# EAGLE schematic power mux-v3 (EAGLE 6.5.0)
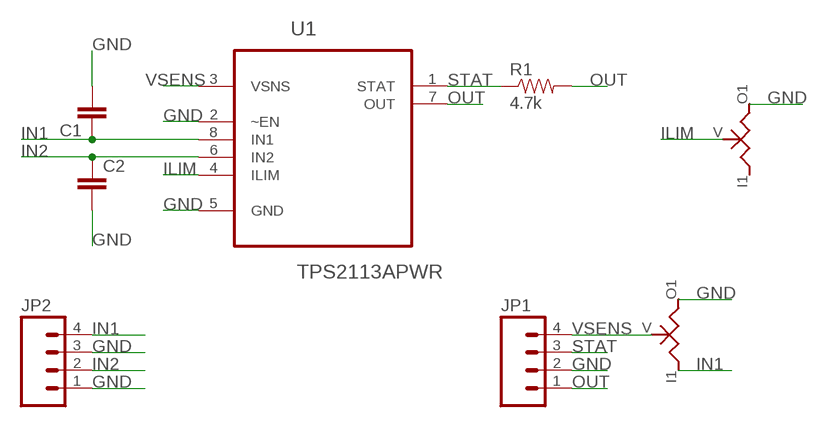
[diagram p0: schematic, sheet 1]

## Parts
C1  CAP0805  [0805]
C2  CAP0805  [0805]
JP1  M04PTH  [1X04]
JP2  M04PTH  [1X04]
R1  4.7k  RESISTOR0805-RES  [0805]
U1  TPS2113APWR  [SOP65P640X120-8N]
U$1  TC33X-2  [TC33X-2]
U$2  TC33X-2  [TC33X-2]

## Nets
GND: C1.2 C2.2 JP1.2 JP2.1 JP2.3 U1.2(~EN) U1.5(GND) U$1.O1(OUT) U$2.O1(OUT)
ILIM: U1.4(ILIM) U$2.V(VAR)
IN1: C1.1 JP2.4 U1.8(IN1) U$1.I1(IN)
IN2: C2.1 JP2.2 U1.6(IN2)
OUT: JP1.1 R1.2 U1.7(OUT)
STAT: JP1.3 R1.1 U1.1(STAT)
VSENS: JP1.4 U1.3(VSNS) U$1.V(VAR)
Unconnected: U$2.I1(IN)

## Library data of the parts
C1 C2 = SparkFun-Capacitors:CAP: Capacitor Standard 0603 ceramic capacitor, and 0.1" leaded capacitor.
JP1 JP2 = SparkFun-Connectors:M04: Header 4 Standard 4-pin 0.1" header. Use with straight break away headers (SKU : PRT-00116), right angle break away headers (PRT-00553), swiss pins (PRT-00743), machine pins (PRT-00117), and female headers (PRT-00115). Molex polarized connector foot print use with SKU : PRT-08231 with associated crimp pins and housings. 1MM SMD Version SKU: PRT-10208
R1 = SparkFun-Passives:RESISTOR: Resistor Basic schematic elements and footprints for 0603, 1206, and PTH resistors.
U1 = Texas Instruments_By_element14_Batch_1:TPS2113APWR: AUTOSWITCHING POWER MUX; MPN: TPS2113APWR; OC_FARNELL: 1757288; OC_NEWARK: 01J0961; PACKAGE: TSSOP-8; SUPPLIER: TEXAS INSTRUMENTS
U$1 U$2 = Richards:TC33X-2